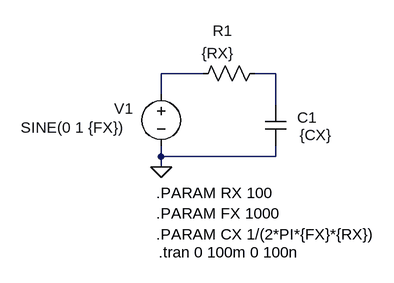
[diagram p0: schematic Calculating_XC.asc]
Calculating_XC.asc, the LTspice schematic file:
Version 4
SHEET 1 880 680
WIRE 160 112 96 112
WIRE 272 112 240 112
WIRE 96 144 96 112
WIRE 272 160 272 112
WIRE 96 240 96 224
WIRE 272 240 272 224
WIRE 272 240 96 240
WIRE 96 256 96 240
FLAG 96 256 0
SYMBOL voltage 96 128 R0
WINDOW 0 -72 38 Left 2
WINDOW 3 -216 67 Left 2
WINDOW 123 0 0 Left 0
WINDOW 39 0 0 Left 0
SYMATTR InstName V1
SYMATTR Value SINE(0 1 {FX})
SYMBOL cap 256 160 R0
WINDOW 0 49 20 Left 2
WINDOW 3 53 47 Left 2
SYMATTR InstName C1
SYMATTR Value {CX}
SYMBOL res 256 96 R90
WINDOW 0 -34 65 VBottom 2
WINDOW 3 -31 73 VTop 2
SYMATTR InstName R1
SYMATTR Value {RX}
TEXT 88 296 Left 2 !.PARAM RX 100
TEXT 88 360 Left 2 !.PARAM CX 1/(2*PI*{FX}*{RX})
TEXT 92 388 Left 2 !.tran 0 100m 0 100n
TEXT 88 328 Left 2 !.PARAM FX 1000

The netlist it stands for:
* Calculating_XC.asc
V1 N001 0 SINE(0 1 {FX})
C1 N002 0 {CX}
R1 N002 N001 {RX}
.PARAM RX 100
.PARAM CX 1/(2*PI*{FX}*{RX})
.tran 0 100m 0 100n
.PARAM FX 1000
.backanno
.end